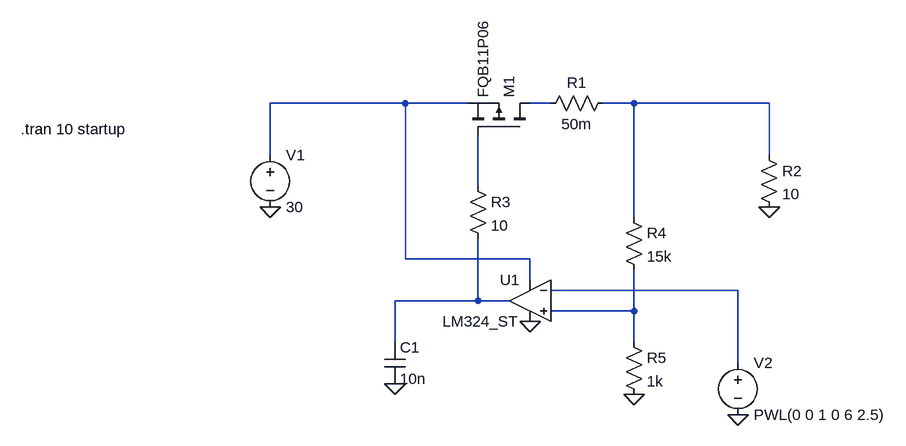
[diagram p0: schematic LDO6.asc]
LDO6.asc, the LTspice schematic file:
Version 4
SHEET 1 1044 680
WIRE 288 0 80 0
WIRE 384 0 288 0
WIRE 512 0 480 0
WIRE 640 0 592 0
WIRE 848 0 640 0
WIRE 80 80 80 0
WIRE 848 80 848 0
WIRE 400 128 400 48
WIRE 640 176 640 0
WIRE 288 240 288 0
WIRE 480 240 288 240
WIRE 480 272 480 240
WIRE 800 288 512 288
WIRE 400 304 400 208
WIRE 400 304 272 304
WIRE 448 304 400 304
WIRE 640 320 640 256
WIRE 640 320 512 320
WIRE 272 368 272 304
WIRE 640 368 640 320
WIRE 800 400 800 288
FLAG 80 160 0
FLAG 848 160 0
FLAG 272 432 0
FLAG 480 336 0
FLAG 800 480 0
FLAG 640 448 0
SYMBOL voltage 80 64 R0
WINDOW 123 0 0 Left 0
WINDOW 39 0 0 Left 0
SYMATTR InstName V1
SYMATTR Value 30
SYMBOL pmos 480 48 M270
SYMATTR InstName M1
SYMATTR Value FQB11P06
SYMBOL res 496 16 R270
WINDOW 0 32 56 VTop 2
WINDOW 3 0 56 VBottom 2
SYMATTR InstName R1
SYMATTR Value 50m
SYMBOL res 832 64 R0
SYMATTR InstName R2
SYMATTR Value 10
SYMBOL ZZZ\\OpAmp\\LM324_ST 480 304 M0
SYMATTR InstName U1
SYMBOL cap 256 368 R0
SYMATTR InstName C1
SYMATTR Value 10n
SYMBOL res 384 112 R0
SYMATTR InstName R3
SYMATTR Value 10
SYMBOL voltage 800 384 R0
WINDOW 123 0 0 Left 0
WINDOW 39 0 0 Left 0
SYMATTR InstName V2
SYMATTR Value PWL(0 0 1 0 6 2.5)
SYMBOL res 624 160 R0
SYMATTR InstName R4
SYMATTR Value 15k
SYMBOL res 624 352 R0
SYMATTR InstName R5
SYMATTR Value 1k
TEXT -304 40 Left 2 !.tran 10 startup

The netlist it stands for:
* LDO6.asc
V1 N001 0 30
M1 N002 N004 N001 N001 FQB11P06
R1 N002 N003 50m
R2 N003 0 10
* U1: LM324_ST (symbol ZZZ\OpAmp\LM324_ST not available, pins judged from their places): In+=N007 In-=N005 V+=N001 V-=0 OUT=N006
C1 N006 0 10n
R3 N004 N006 10
V2 N005 0 PWL(0 0 1 0 6 2.5)
R4 N003 N007 15k
R5 N007 0 1k
.model NMOS NMOS
.model PMOS PMOS
.lib standard.mos
.tran 10 startup
.backanno
.end